# EAGLE design design (EAGLE 9.5.2)
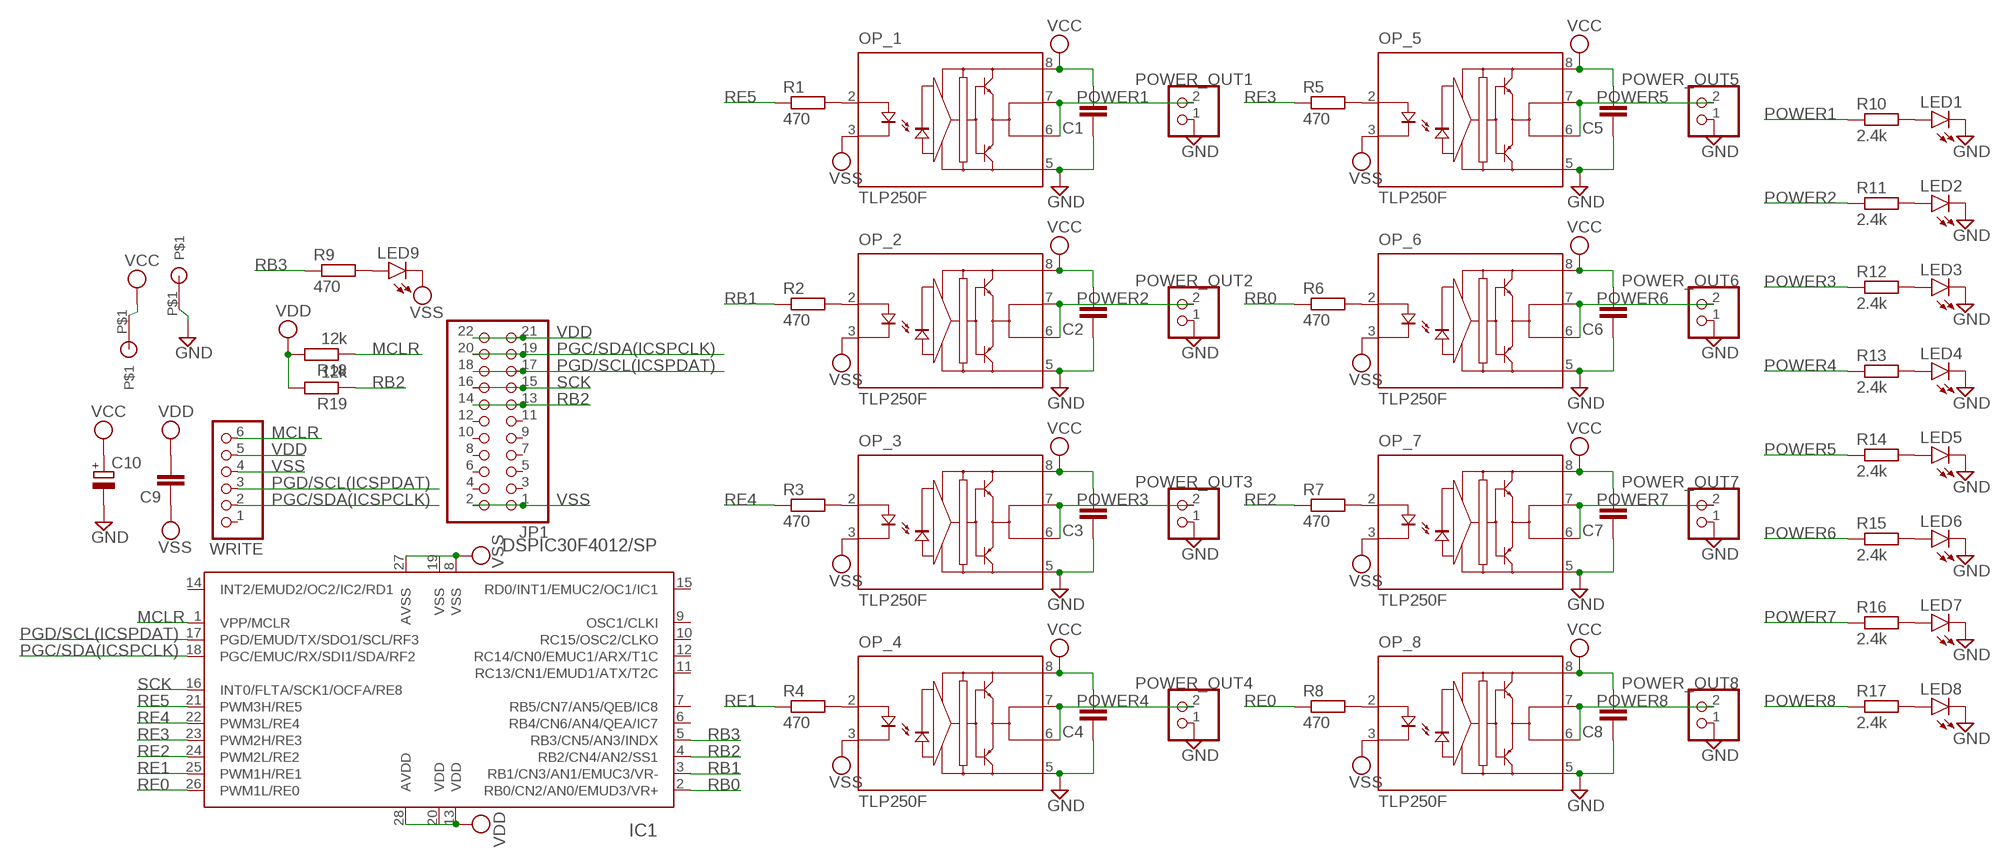
[diagram p0: schematic, sheet 1]

## Parts
C1  C-EUC2012  [C2012]
C2  C-EUC2012  [C2012]
C3  C-EUC2012  [C2012]
C4  C-EUC2012  [C2012]
C5  C-EUC2012  [C2012]
C6  C-EUC2012  [C2012]
C7  C-EUC2012  [C2012]
C8  C-EUC2012  [C2012]
C9  C-EUC2012  [C2012]
C10  CPOL-EUE5-13  [E5-13]
IC1  DSPIC30F4012/SP  [DIL28-3]
JP1  PINHD-2X11/90  [2X11/90]
LED1  LEDCHIPLED_0603  [CHIPLED_0603]
LED2  LEDCHIPLED_0603  [CHIPLED_0603]
LED3  LEDCHIPLED_0603  [CHIPLED_0603]
LED4  LEDCHIPLED_0603  [CHIPLED_0603]
LED5  LEDCHIPLED_0603  [CHIPLED_0603]
LED6  LEDCHIPLED_0603  [CHIPLED_0603]
LED7  LEDCHIPLED_0603  [CHIPLED_0603]
LED8  LEDCHIPLED_0603  [CHIPLED_0603]
LED9  LEDCHIPLED_0603  [CHIPLED_0603]
OP_1  TLP250F  [DIL08]
OP_2  TLP250F  [DIL08]
OP_3  TLP250F  [DIL08]
OP_4  TLP250F  [DIL08]
OP_5  TLP250F  [DIL08]
OP_6  TLP250F  [DIL08]
OP_7  TLP250F  [DIL08]
OP_8  TLP250F  [DIL08]
POWER_OUT1  PINHD-1X2/90  [1X02/90]
POWER_OUT2  PINHD-1X2/90  [1X02/90]
POWER_OUT3  PINHD-1X2/90  [1X02/90]
POWER_OUT4  PINHD-1X2/90  [1X02/90]
POWER_OUT5  PINHD-1X2/90  [1X02/90]
POWER_OUT6  PINHD-1X2/90  [1X02/90]
POWER_OUT7  PINHD-1X2/90  [1X02/90]
POWER_OUT8  PINHD-1X2/90  [1X02/90]
R1  470  R-EU_M0805  [M0805]
R2  470  R-EU_M0805  [M0805]
R3  470  R-EU_M0805  [M0805]
R4  470  R-EU_M0805  [M0805]
R5  470  R-EU_M0805  [M0805]
R6  470  R-EU_M0805  [M0805]
R7  470  R-EU_M0805  [M0805]
R8  470  R-EU_M0805  [M0805]
R9  470  R-EU_M0805  [M0805]
R10  2.4k  R-EU_M0805  [M0805]
R11  2.4k  R-EU_M0805  [M0805]
R12  2.4k  R-EU_M0805  [M0805]
R13  2.4k  R-EU_M0805  [M0805]
R14  2.4k  R-EU_M0805  [M0805]
R15  2.4k  R-EU_M0805  [M0805]
R16  2.4k  R-EU_M0805  [M0805]
R17  2.4k  R-EU_M0805  [M0805]
R18  12k  R-EU_M0805  [M0805]
R19  12k  R-EU_M0805  [M0805]
U$1  MARU  [MARU]
U$8  MARU  [MARU]
WRITE  PINHD-1X6/90  [1X06/90]

## Nets
GND: C1.1 C2.1 C3.1 C4.1 C5.1 C6.1 C7.1 C8.1 C10.- LED1.C LED2.C LED3.C LED4.C LED5.C LED6.C LED7.C LED8.C OP_1.5(GND) OP_2.5(GND) OP_3.5(GND) OP_4.5(GND) OP_5.5(GND) OP_6.5(GND) OP_7.5(GND) OP_8.5(GND) POWER_OUT1.1 POWER_OUT2.1 POWER_OUT3.1 POWER_OUT4.1 POWER_OUT5.1 POWER_OUT6.1 POWER_OUT7.1 POWER_OUT8.1 U$1.P$1
MCLR: IC1.1(VPP/MCLR) R18.1 WRITE.6
N$1: OP_1.2(A) R1.2
N$2: OP_2.2(A) R2.2
N$3: OP_3.2(A) R3.2
N$4: OP_4.2(A) R4.2
N$5: OP_5.2(A) R5.2
N$6: OP_6.2(A) R6.2
N$7: OP_7.2(A) R7.2
N$8: OP_8.2(A) R8.2
N$9: LED9.A R9.2
N$10: LED1.A R10.2
N$11: LED2.A R11.2
N$12: LED3.A R12.2
N$13: LED4.A R13.2
N$14: LED6.A R15.2
N$15: LED5.A R14.2
N$16: LED7.A R16.2
N$17: LED8.A R17.2
PGC/SDA(ICSPCLK): IC1.18(PGC/EMUC/RX/SDI1/SDA/RF2) JP1.19 JP1.20 WRITE.2
PGD/SCL(ICSPDAT): IC1.17(PGD/EMUD/TX/SDO1/SCL/RF3) JP1.17 JP1.18 WRITE.3
POWER1: OP_1.6(VO) OP_1.7(VO') POWER_OUT1.2 R10.1
POWER2: OP_2.6(VO) OP_2.7(VO') POWER_OUT2.2 R11.1
POWER3: OP_3.6(VO) OP_3.7(VO') POWER_OUT3.2 R12.1
POWER4: OP_4.6(VO) OP_4.7(VO') POWER_OUT4.2 R13.1
POWER5: OP_5.6(VO) OP_5.7(VO') POWER_OUT5.2 R14.1
POWER6: OP_6.6(VO) OP_6.7(VO') POWER_OUT6.2 R15.1
POWER7: OP_7.6(VO) OP_7.7(VO') POWER_OUT7.2 R16.1
POWER8: OP_8.6(VO) OP_8.7(VO') POWER_OUT8.2 R17.1
RB0: IC1.2(RB0/CN2/AN0/EMUD3/VR+) R6.1
RB1: IC1.3(RB1/CN3/AN1/EMUC3/VR-) R2.1
RB2: IC1.4(RB2/CN4/AN2/SS1) JP1.13 JP1.14 R19.1
RB3: IC1.5(RB3/CN5/AN3/INDX) R9.1
RE0: IC1.26(PWM1L/RE0) R8.1
RE1: IC1.25(PWM1H/RE1) R4.1
RE2: IC1.24(PWM2L/RE2) R7.1
RE3: IC1.23(PWM2H/RE3) R5.1
RE4: IC1.22(PWM3L/RE4) R3.1
RE5: IC1.21(PWM3H/RE5) R1.1
SCK: IC1.16(INT0/FLTA/SCK1/OCFA/RE8) JP1.15 JP1.16
VCC: C1.2 C2.2 C3.2 C4.2 C5.2 C6.2 C7.2 C8.2 C10.+ OP_1.8(VCC) OP_2.8(VCC) OP_3.8(VCC) OP_4.8(VCC) OP_5.8(VCC) OP_6.8(VCC) OP_7.8(VCC) OP_8.8(VCC) U$8.P$1
VDD: C9.2 IC1.13(VDD) IC1.20(VDD) IC1.28(AVDD) JP1.21 JP1.22 R18.2 R19.2 WRITE.5
VSS: C9.1 IC1.8(VSS) IC1.19(VSS) IC1.27(AVSS) JP1.1 JP1.2 LED9.C OP_1.3(K) OP_2.3(K) OP_3.3(K) OP_4.3(K) OP_5.3(K) OP_6.3(K) OP_7.3(K) OP_8.3(K) WRITE.4
Unconnected: IC1.6(RB4/CN6/AN4/QEA/IC7) IC1.7(RB5/CN7/AN5/QEB/IC8) IC1.9(OSC1/CLKI) IC1.10(RC15/OSC2/CLKO) IC1.11(RC13/CN1/EMUD1/ATX/T2C) IC1.12(RC14/CN0/EMUC1/ARX/T1C) IC1.14(INT2/EMUD2/OC2/IC2/RD1) IC1.15(RD0/INT1/EMUC2/OC1/IC1) JP1.3 JP1.4 JP1.5 JP1.6 JP1.7 JP1.8 JP1.9 JP1.10 JP1.11 JP1.12 WRITE.1

## Library data of the parts
C1-C9 = rcl:C-EU: CAPACITOR, European symbol; SPICEPREFIX: C
C10 = rcl:CPOL-EU: POLARIZED CAPACITOR, European symbol; SPICEPREFIX: C
IC1 = microchip-dspic:DSPIC30F4012: dsPIC Motion Controller DSC
JP1 = pinhead:PINHD-2X11: PIN HEADER
LED1-LED9 = led:LED: LED OSRAM: - CHIPLED LG R971, LG N971, LY N971, LG Q971, LY Q971, LO R971, LY R971 LH N974, LH R974 LS Q976, LO Q976, LY Q976 LO Q996 - Hyper CHIPLED LW Q18S LB Q993, LB Q99A, LB R99A - SideLED LS A670, LO A670, LY A670, LG A670, LP A670 LB A673, LV A673, LT A673, LW A673 LH A674 LY A675 LS A676, LA A676, LO A676, LY A676, LW A676 LS A679, LY A679, LG A679 - Hyper Micro SIDELED® LS Y876, LA Y876, LO Y876, LY Y876 LT Y87S - SmartLED LW L88C, LW L88S LB L89C, LB L89S, LG L890 LS L89K, LO L89K, LY L89K LS L896, LA L896, LO L896, LY L896 - TOPLED LS T670, LO T670, LY T670, LG T670, LP T670 LSG T670, LSP T670, LSY T670, LOP T670, LYG T670 LG T671, LOG T671, LSG T671 LB T673, LV T673, LT T673, LW T673 LH T674 LS T676, LA T676, LO T676, LY T676, LB T676, LH T676, LSB T676, LW T676 LB T67C, LV T67C, LT T67C, LS T67K, LO T67K, LY T67K, LW E67C LS E67B, LA E67B, LO E67B, LY E67B, LB E67C, LV E67C, LT E67C LW T67C LS T679, LY T679, LG T679 LS T770, LO T770, LY T770, LG T770, LP T770 LB T773, LV T773, LT T773, LW T773 LH T774 LS E675, LA E675, LY E675, LS T675 LS T776, LA T776, LO T776, LY T776, LB T776 LHGB T686 LT T68C, LB T68C - Hyper Mini TOPLED® LB M676 - Mini TOPLED Santana® LG M470 LS M47K, LO M47K, LY M47K Source: http://www.osram.convergy.de LUXEON: - LUMILED® LXK2-PW12-R00, LXK2-PW12-S00, LXK2-PW14-U00, LXK2-PW14-V00 LXK2-PM12-R00, LXK2-PM12-S00, LXK2-PM14-U00 LXK2-PE12-Q00, LXK2-PE12-R00, LXK2-PE12-S00, LXK2-PE14-T00, LXK2-PE14-U00 LXK2-PB12-K00, LXK2-PB12-L00, LXK2-PB12-M00, LXK2-PB14-N00, LXK2-PB14-P00, LXK2-PB14-Q00 LXK2-PR12-L00, LXK2-PR12-M00, LXK2-PR14-Q00, LXK2-PR14-R00 LXK2-PD12-Q00, LXK2-PD12-R00, LXK2-PD12-S00 LXK2-PH12-R00, LXK2-PH12-S00 LXK2-PL12-P00, LXK2-PL12-Q00, LXK2-PL12-R00 Source: www.luxeon.com KINGBRIGHT: KA-3528ASYC Source: www.kingbright.com
OP_1-OP_8 = optocoupler-3-jcn:TLP250F: Toshiba Transistor Inverter Inverter For Air Conditionor IGBT Gate Drive Power MOS FET Gate Drive
POWER_OUT1-POWER_OUT8 = pinhead:PINHD-1X2: PIN HEADER
R1-R19 = rcl:R-EU_: RESISTOR, European symbol; SPICEPREFIX: R
U$1 U$8 = abouters_hira:MARU
WRITE = pinhead:PINHD-1X6: PIN HEADER

## Board
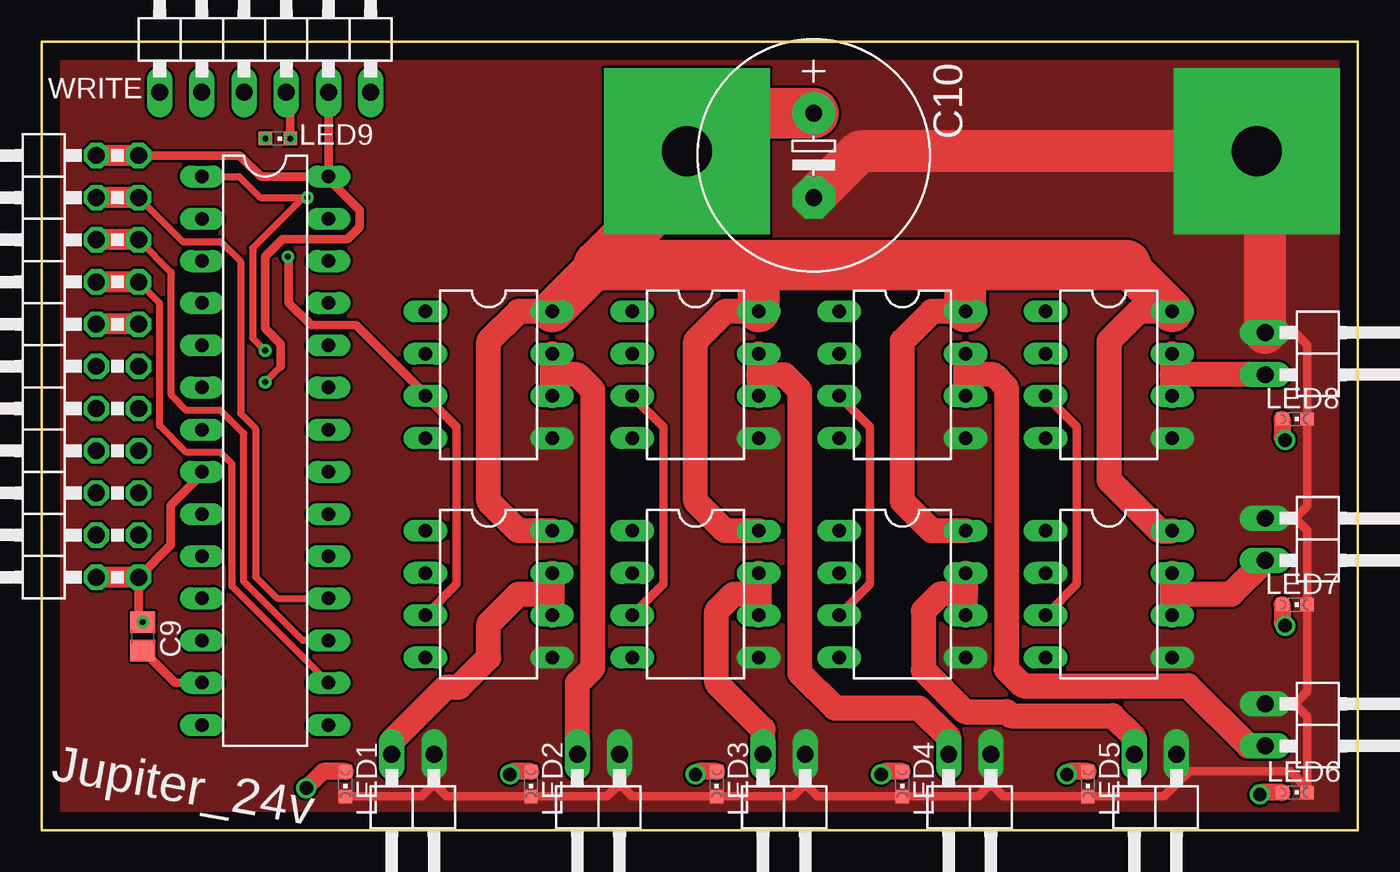
[diagram p1: board, top side]
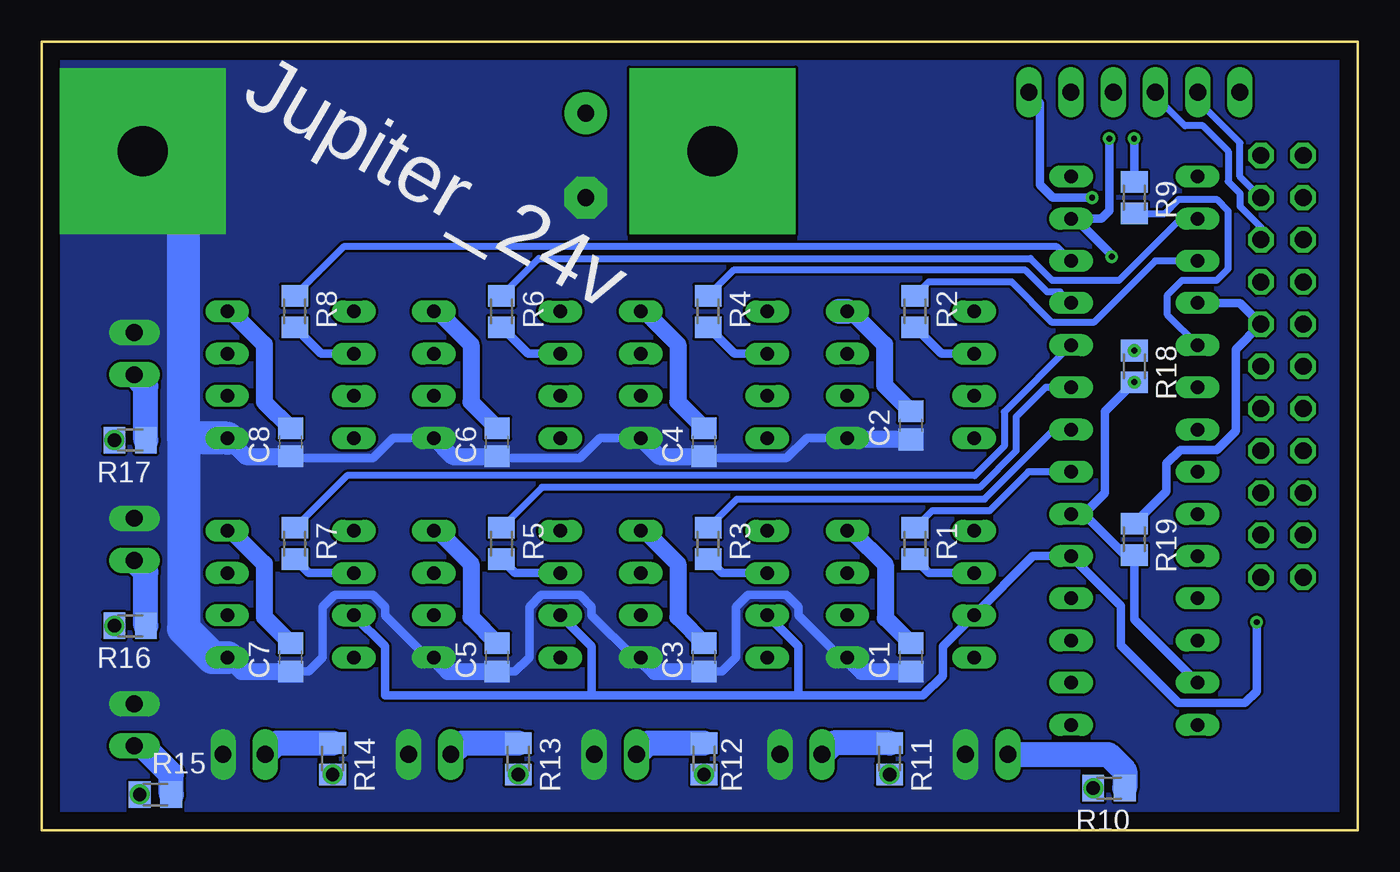
[diagram p2: board, bottom side, seen from below]

Size 79.25 x 47.5 mm. Coordinates in mm from the lower left corner, seen from the top.
Outline: 0,0 0,47.5 79.25,47.5 79.25,0 0,0
Copper layers (1*16): Top 0.035mm / dielectric 1.5mm / Bottom 0.035mm
Design rules "default *": minimum track width 6mil, minimum drill 0.35mm, track to track 6mil, track to pad 6mil, pad to pad 6mil, via to via 6mil, smd to smd 6mil, copper to edge 40mil, drill to drill 6mil, minimum pad ring 10mil, minimum via ring 8mil, stop-mask expansion 4mil, vias tented up to drill 0mil, thermal gap 10mil

### Footprints (pad centres in the part's own frame; a part is rotated, then mirrored left to right if it is on the bottom)
C2012 = smd 1.3 x 1.5: 1 -0.85,0; 2 0.85,0
E5-13 = drill 1.016 pad 2.54: + -2.54,0 | drill 1.016 pad 2.54 octagon: - 2.54,0
DIL28-3 = drill 0.813 long: 1 -16.51,-3.81; 2 -13.97,-3.81; 3 -11.43,-3.81; 4 -8.89,-3.81; 5 -6.35,-3.81; 6 -3.81,-3.81; 7 -1.27,-3.81; 8 1.27,-3.81; 9 3.81,-3.81; 10 6.35,-3.81; 11 8.89,-3.81; 12 11.43,-3.81; 13 13.97,-3.81; 14 16.51,-3.81; 15 16.51,3.81; 16 13.97,3.81; 17 11.43,3.81; 18 8.89,3.81; 19 6.35,3.81; 20 3.81,3.81; 21 1.27,3.81; 22 -1.27,3.81; 23 -3.81,3.81; 24 -6.35,3.81; 25 -8.89,3.81; 26 -11.43,3.81; 27 -13.97,3.81; 28 -16.51,3.81
2X11/90 = drill 1.016 octagon: 1 -12.7,-6.35; 2 -12.7,-3.81; 3 -10.16,-6.35; 4 -10.16,-3.81; 5 -7.62,-6.35; 6 -7.62,-3.81; 7 -5.08,-6.35; 8 -5.08,-3.81; 9 -2.54,-6.35; 10 -2.54,-3.81; 11 0,-6.35; 12 0,-3.81; 13 2.54,-6.35; 14 2.54,-3.81; 15 5.08,-6.35; 16 5.08,-3.81; 17 7.62,-6.35; 18 7.62,-3.81; 19 10.16,-6.35; 20 10.16,-3.81; 21 12.7,-6.35; 22 12.7,-3.81
CHIPLED_0603 = smd 0.8 x 0.8: A 0,-0.75; C 0,0.75
DIL08 = drill 0.813 long: 1 -3.81,-3.81; 2 -1.27,-3.81; 3 1.27,-3.81; 4 3.81,-3.81; 5 3.81,3.81; 6 1.27,3.81; 7 -1.27,3.81; 8 -3.81,3.81
1X02/90 = drill 1.016 long: 1 -1.27,-3.81; 2 1.27,-3.81
M0805 = smd 1.3 x 1.6: 1 -0.95,0; 2 0.95,0
MARU = drill 3 pad 10 square: P$1 0,0
1X06/90 = drill 1.016 long: 1 -6.35,-3.81; 2 -3.81,-3.81; 3 -1.27,-3.81; 4 1.27,-3.81; 5 3.81,-3.81; 6 6.35,-3.81

### Placement (x,y rotation side)
C1  26.92,10.41 90 bottom
C2  26.92,24.38 90 bottom
C3  39.37,10.41 90 bottom
C4  39.37,23.37 90 bottom
C5  51.82,10.41 90 bottom
C6  51.82,23.37 90 bottom
C7  64.26,10.41 90 bottom
C8  64.26,23.37 90 bottom
C9  6.1,11.68 270 top
C10  46.48,40.64 270 top
IC1  13.46,22.86 270 top
JP1  -0.51,27.94 90 top
LED1  18.29,2.79 180 top
LED2  29.46,2.79 180 top
LED3  40.64,2.79 180 top
LED4  51.82,2.79 180 top
LED5  62.99,2.79 180 top
LED6  75.44,2.29 270 top
LED7  75.44,13.59 270 top
LED8  75.44,24.77 270 top
LED9  14.22,41.66 270 top
OP_1  26.92,14.22 270 top
OP_2  26.92,27.43 270 top
OP_3  39.37,14.22 270 top
OP_4  39.37,27.43 270 top
OP_5  51.82,14.22 270 top
OP_6  51.82,27.43 270 top
OP_7  64.26,14.22 270 top
OP_8  64.26,27.43 270 top
POWER_OUT1  22.35,0.76 180 top
POWER_OUT2  33.53,0.76 180 top
POWER_OUT3  44.7,0.76 180 top
POWER_OUT4  55.88,0.76 180 top
POWER_OUT5  67.06,0.76 180 top
POWER_OUT6  77.47,6.35 270 top
POWER_OUT7  77.47,17.53 270 top
POWER_OUT8  77.47,28.7 270 top
R1  26.67,17.27 270 bottom
R2  26.67,31.24 270 bottom
R3  39.12,17.27 270 bottom
R4  39.12,31.24 270 bottom
R5  51.56,17.27 270 bottom
R6  51.56,31.24 270 bottom
R7  64.01,17.27 270 bottom
R8  64.01,31.24 270 bottom
R9  13.46,38.1 90 bottom
R10  14.99,2.54 180 bottom
R11  28.19,4.32 270 bottom
R12  39.37,4.32 270 bottom
R13  50.55,4.32 270 bottom
R14  61.72,4.32 270 bottom
R15  72.39,2.16 180 bottom
R16  73.91,12.32 180 bottom
R17  73.91,23.5 180 bottom
R18  13.46,27.94 270 bottom
R19  13.46,17.53 270 bottom
U$1  73.15,40.89 0 top
U$8  38.86,40.89 0 top
WRITE  13.46,48.26 0 top

### Tracks (layer width: path | path; a pad name or v marks a point on that pad's centre or on a via)
GND
  Top 0.508: LED1.C 22.87,2.04 23.62,2.79 | 23.62,2.79 POWER_OUT1.1 | 34.8,2.79 34.05,2.04 LED2.C 24.37,2.04 23.62,2.79 | 34.8,2.79 POWER_OUT2.1 | 45.97,2.79 45.22,2.04 LED3.C 35.55,2.04 34.8,2.79 | 45.97,2.79 POWER_OUT3.1 | 57.15,2.79 56.4,2.04 LED4.C 46.72,2.04 45.97,2.79 | POWER_OUT4.1 57.15,2.79 | 68.33,2.79 67.58,2.04 LED5.C 57.9,2.04 57.15,2.79 | 68.33,2.79 POWER_OUT5.1 | LED6.C 76.19,2.54 | 76.19,2.54 76.19,6.87 75.44,7.62 | POWER_OUT6.1 75.44,7.62 | 75.44,18.8 76.19,18.05 LED7.C 76.19,8.37 75.44,7.62 | 75.44,18.8 POWER_OUT7.1 | POWER_OUT8.1 75.44,29.97 76.19,29.22 LED8.C 76.19,19.55 75.44,18.8 | 68.33,2.79 69.09,3.56 75.17,3.56 76.19,2.54
  Top 2.54: C10.- 49.28,40.89 U$1.P$1 73.66,40.39 POWER_OUT8.1
  Bottom 0.508: OP_2.5 33.18,23.62 34.4,22.41 39.26,22.41 C4.1 | OP_4.5 45.63,23.62 46.84,22.41 51.71,22.41 C6.1 | OP_6.5 58.07,23.62 59.29,22.41 64.15,22.41 C8.1 | OP_1.5 31.14,10.41 33.69,12.95 33.69,13.46 34.4,14.17 36.72,14.17 37.44,13.46 37.44,10.41 38.28,9.56 C3.1 | OP_3.5 43.59,10.41 46.13,12.95 46.13,13.46 46.84,14.17 49.17,14.17 49.88,13.46 49.88,10.41 50.73,9.56 C5.1 | OP_5.5 56.04,10.41 58.58,12.95 58.58,13.46 59.29,14.17 61.62,14.17 62.33,13.46 62.33,10.41 63.18,9.56 C7.1
  Bottom 1.016: OP_1.5 29.88,9.56 C1.1 | OP_3.5 42.33,9.56 C3.1 | OP_5.5 54.78,9.56 C5.1 | OP_7.5 67.22,9.56 C7.1 | C2.1 30.65,23.53 OP_2.5 | OP_4.5 42.08,22.52 C4.1 | OP_8.5 66.97,22.52 C8.1 | OP_6.5 54.52,22.52 C6.1
  Bottom 2: OP_7.5 68.97,10.41 70.69,12.14 70.69,23.62 | OP_8.5 70.69,23.62 | 70.69,23.62 70.69,38.43 U$1.P$1
  pour Top (no thermals): 0,47.5 0,0 79.25,0 79.25,47.5
  pour Bottom (no thermals): 0,47.5 0,0 79.25,0 79.25,47.5
MCLR  (via drill 0.35)
  Top 0.406: IC1.1 11.9,39.37 13.17,38.1 v16,38.1 15.75,38.1 14.99,37.34 12.7,35.05 12.7,29.65 R18.1
  Bottom 0.508: WRITE.6 19.15,43.78 19.15,38.87 18.38,38.1 v16,38.1
  other vias: 13.46,28.89
N$1
  Bottom 0.508: OP_1.2 25.84,15.49 R1.2
N$2
  Bottom 0.508: OP_2.2 25.08,28.7 R2.2
N$3
  Bottom 0.508: OP_3.2 38.29,15.49 R3.2
N$4
  Bottom 0.508: R4.2 37.53,28.7 OP_4.2
N$5
  Bottom 0.508: OP_5.2 50.73,15.49 R5.2
N$6
  Bottom 0.508: R6.2 49.97,28.7 OP_6.2
N$7
  Bottom 0.508: OP_7.2 63.18,15.49 R7.2
N$8
  Bottom 0.508: R8.2 62.42,28.7 OP_8.2
N$9  (via drill 0.35)
  Bottom 0.508: R9.2 13.46,41.64 LED9.A
  other vias: 13.47,41.66
N$10  (via drill 0.8)
  Top 1.016: LED1.A 16.94,3.54 R10.2
  other vias: 15.94,2.54
N$11  (via drill 0.8)
  Top 1.016: LED2.A 28.37,3.54 R11.2
  other vias: 28.19,3.37
N$12  (via drill 0.8)
  Top 1.016: LED3.A 39.55,3.54 R12.2
  other vias: 39.37,3.37
N$13  (via drill 0.8)
  Top 1.016: LED4.A 50.72,3.54 R13.2
  other vias: 50.55,3.37
N$14  (via drill 0.8)
  Top 1.016: LED6.A 73.47,2.29 R15.2
  other vias: 73.34,2.16
N$15  (via drill 0.8)
  Top 1.016: LED5.A 61.9,3.54 R14.2
  other vias: 61.72,3.37
N$16  (via drill 0.8)
  Top 1.016: LED7.A 74.69,12.5 R16.2
  other vias: 74.86,12.32
N$17  (via drill 0.8)
  Top 1.016: LED8.A 74.69,23.67 R17.2
  other vias: 74.86,23.5
PGC/SDA(ICSPCLK)
  Top 0.406: JP1.19 8.49,35.45 10.79,35.45 11.98,34.26 11.98,25.1 12.89,24.2 12.89,15.27 14.19,13.97 IC1.18
  Top 1.27: JP1.19 JP1.20
  Bottom 0.406: JP1.19 7.11,39.36 7.11,41.4 9.65,43.94 WRITE.2
PGD/SCL(ICSPDAT)
  Top 0.406: IC1.17 15.73,11.43 12.18,14.98 12.18,23.91 10.79,25.29 8.72,25.29 7.81,26.2 7.81,33.59 JP1.17
  Top 1.27: JP1.17 JP1.18
  Bottom 0.406: WRITE.3 12.19,44.2 10.41,42.42 9.34,42.42 7.81,40.89 7.81,39.07 7.11,38.37 7.11,37.58 5.84,36.31 JP1.17
POWER1
  Top 1.5: OP_1.7 30.73,14.22 | 30.73,14.22 OP_1.6 | POWER_OUT1.2 21.08,5.36 24.36,8.64 25.15,8.64 26.92,10.41 26.92,12.45 28.7,14.22 30.73,14.22
  Bottom 1.5: POWER_OUT1.2 15.03,4.57 14.04,3.58 R10.1
POWER2
  Top 1.5: OP_2.7 30.73,27.43 | 30.73,27.43 OP_2.6 | POWER_OUT2.2 32.26,8.86 33.19,9.79 33.19,26.5 32.26,27.43 30.73,27.43
  Bottom 1.5: R11.1 31.56,5.27 POWER_OUT2.2
POWER3
  Top 1.5: OP_3.7 43.18,14.22 | 43.18,14.22 OP_3.6 | 43.18,14.22 41.66,14.22 40.64,13.21 40.64,8.89 43.43,6.1 POWER_OUT3.2
  Bottom 1.5: POWER_OUT3.2 42.74,5.27 R12.1
POWER4
  Top 1.5: OP_4.7 43.18,27.43 | 43.18,27.43 OP_4.6 | 43.18,27.43 44.7,27.43 45.64,26.5 45.64,9.48 47.75,7.37 52.83,7.37 54.61,5.59 POWER_OUT4.2
  Bottom 1.5: POWER_OUT4.2 53.91,5.27 R13.1
POWER5
  Top 1.5: OP_5.7 55.63,14.22 | OP_5.6 55.63,14.22 | 55.63,14.22 54.1,14.22 53.09,13.21 53.09,9.66 55.6,7.15 58.09,7.15 58.34,6.9 64.47,6.9 65.79,5.59 POWER_OUT5.2
  Bottom 1.5: POWER_OUT5.2 65.09,5.27 R14.1
POWER6
  Top 1.5: OP_6.7 55.63,27.43 | 55.63,27.43 OP_6.6 | 55.63,27.43 57.32,27.43 58.08,26.67 58.08,9.71 59.08,8.7 69.02,8.7 72.64,5.08 POWER_OUT6.2
  Bottom 1.5: R15.1 71.44,3.37 73.15,5.08 POWER_OUT6.2
POWER7
  Top 1.5: OP_7.6 68.07,14.22 | 68.07,14.22 OP_7.7 | POWER_OUT7.2 71.63,14.22 68.07,14.22
  Bottom 1.5: R16.1 72.96,15.56 POWER_OUT7.2
POWER8
  Top 1.5: OP_8.7 68.07,27.43 | 68.07,27.43 OP_8.6 | POWER_OUT8.2 68.07,27.43
  Bottom 1.5: R17.1 72.96,26.74 POWER_OUT8.2
RB0
  Bottom 0.406: R6.1 49.32,34.43 19.72,34.43 18.41,33.13 14.37,33.13 10.67,36.83 IC1.2
RB1
  Bottom 0.406: IC1.3 12.21,34.29 15.91,30.59 18.41,30.59 20.85,33.02 25.84,33.02 R2.1
RB2
  Top 1.27: JP1.13 JP1.14
  Bottom 0.508: R19.1 11.53,20.41 11.53,22.09 10.7,22.92 8.49,22.92 7.37,24.04 7.37,28.96 JP1.13 7.11,31.75 IC1.4
RB3
  Bottom 0.406: R9.1 11.64,37.15 10.79,37.99 8.51,37.99 7.83,37.31 7.83,33.81 8.51,33.13 10.58,33.13 11.48,32.23 11.48,31.03 IC1.5
RE0
  Bottom 0.406: IC1.26 18.12,35.14 61.06,35.14 R8.1
RE1
  Bottom 0.406: IC1.25 17.94,32.42 18.71,32.42 20.01,33.72 37.58,33.72 R4.1
RE2
  Bottom 0.406: IC1.24 21.29,25.19 21.29,23.14 23.07,21.37 60.87,21.37 R7.1
RE3
  Bottom 0.406: IC1.23 18.81,26.67 20.58,24.9 20.58,22.85 22.77,20.66 49.13,20.66 R5.1
RE4
  Bottom 0.406: R3.1 37.39,19.95 22.48,19.95 18.3,24.13 IC1.22
RE5
  Bottom 0.406: IC1.21 19.84,21.59 22.19,19.25 25.65,19.25 R1.1
SCK
  Top 0.406: IC1.16 11.48,14.69 11.48,22.07 10.79,22.75 8.72,22.75 7.11,24.37 7.11,31.75 JP1.15
  Top 1.27: JP1.15 JP1.16
VCC
  Top 1.5: OP_2.8 28.7,31.24 26.92,29.46 26.92,19.81 28.7,18.03 OP_1.8 | OP_4.8 41.15,31.24 39.37,29.46 39.37,19.81 41.15,18.03 OP_3.8 | OP_6.8 53.59,31.24 51.82,29.46 51.82,19.81 53.59,18.03 OP_5.8 | OP_8.8 66.04,31.24 64.26,29.46 64.26,21.09 67.32,18.03 OP_7.8
  Top 2.54: OP_2.8 33.53,34.04 | OP_8.8 65.28,34.04 | OP_4.8 43.18,34.04 | OP_6.8 55.63,34.04
  Top 3.048: C10.+ 41.15,43.18 U$8.P$1 38.86,39.37 33.53,34.04 43.18,34.04 55.63,34.04 65.28,34.04
  Bottom 1.016: OP_1.8 30.48,18.03 28.45,16 28.45,12.79 C1.2 | OP_3.8 42.93,18.03 40.95,16.05 40.95,12.84 C3.2 | OP_5.8 55.37,18.03 53.39,16.05 53.39,12.84 C5.2 | OP_7.8 67.82,18.03 65.84,16.05 65.84,12.84 C7.2 | OP_2.8 30.48,31.24 28.5,29.26 28.5,26.81 C2.2 | OP_8.8 67.82,31.24 65.84,29.26 65.84,25.79 C8.2 | OP_6.8 55.37,31.24 53.39,29.26 53.39,25.79 C6.2 | OP_4.8 42.93,31.24 40.95,29.26 40.95,25.79 C4.2
  Bottom 1.5: OP_2.8 31.24,31.24
VDD  (via drill 0.35)
  Top 0.406: 14.39,27.92 R18.2
  Top 0.508: IC1.13 8.04,8.89 C9.2 | WRITE.5 IC1.28 | JP1.21 11.94,40.64 13.21,39.37 IC1.28 | IC1.28 17.27,39.21 19.15,37.33 19.15,36.33 18.43,35.62 14.53,35.62 13.46,34.54 13.46,30.23 14.39,29.29 14.39,27.92
  Top 1.27: JP1.21 JP1.22
  Bottom 0.508: 16.51,19.05 14.04,16.58 R19.2 13.46,12.7 IC1.13 | R18.2 15.24,25.21 15.24,20.32 16.51,19.05 | 16.51,19.05 IC1.20
  other vias: 13.46,26.99
VSS  (via drill 0.35)
  Top 0.508: IC1.8 9.65,21.43 7.78,19.55 7.78,17.18 JP1.1 5.84,12.79 C9.1 | WRITE.4 14.97,44.21 LED9.C | v14.82,34.54 14.89,34.47 14.89,31.75 16.22,30.42 18.94,30.42 23.11,26.25 OP_2.3 24.99,24.29 24.99,14.83 OP_1.3 | OP_3.3 37.44,14.83 37.44,24.29 OP_4.3 | OP_6.3 49.88,24.29 49.88,14.83 OP_5.3 | OP_8.3 62.33,24.29 62.33,14.83 OP_7.3
  Top 1.27: JP1.1 JP1.2
  Bottom 0.508: v14.82,34.54 14.82,34.63 17.02,36.83 IC1.27 15.45,36.83 14.97,37.3 LED9.C | OP_3.3 33.69,11.08 33.69,8.13 | 33.69,8.13 26.18,8.13 24.99,9.32 24.99,11.08 OP_1.3 19.56,16.51 IC1.19 14.27,13.51 14.27,11.13 10.82,7.68 6.8,7.68 6.1,8.38 C9.1 | 33.69,8.13 46.13,8.13 | OP_7.3 58.58,11.08 58.58,8.13 46.13,8.13 | OP_5.3 46.13,11.08 46.13,8.13
  other vias: 14.97,41.66 6.1,12.53

### Text on the board
tNames: Jupiter_24v
bNames: Jupiter_24v